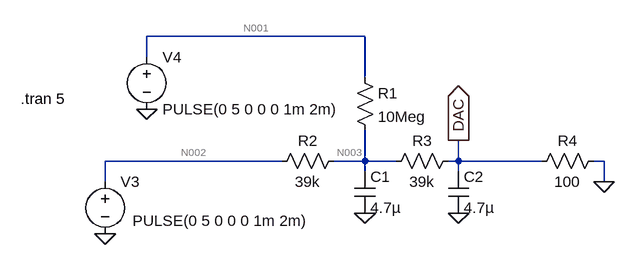
[diagram p0: schematic control-amp.asc]
control-amp.asc, the LTspice schematic file:
Version 4
SHEET 1 880 680
WIRE -496 -176 -832 -176
WIRE -832 -144 -832 -176
WIRE -496 -112 -496 -176
WIRE -624 16 -896 16
WIRE -496 16 -496 -32
WIRE -496 16 -544 16
WIRE -448 16 -496 16
WIRE -352 16 -352 -16
WIRE -352 16 -368 16
WIRE -224 16 -352 16
WIRE -128 16 -144 16
WIRE -496 32 -496 16
WIRE -352 32 -352 16
WIRE -896 48 -896 16
WIRE -128 48 -128 16
FLAG -896 128 0
FLAG -832 -64 0
FLAG -496 96 0
FLAG -352 96 0
FLAG -352 -16 DAC
IOPIN -352 -16 Out
FLAG -128 48 0
SYMBOL res -512 -128 R0
SYMATTR InstName R1
SYMATTR Value 10Meg
SYMBOL res -528 0 R90
WINDOW 0 0 56 VBottom 2
WINDOW 3 32 56 VTop 2
SYMATTR InstName R2
SYMATTR Value 39k
SYMBOL res -352 0 R90
WINDOW 0 0 56 VBottom 2
WINDOW 3 32 56 VTop 2
SYMATTR InstName R3
SYMATTR Value 39k
SYMBOL voltage -896 32 R0
WINDOW 123 0 0 Left 0
WINDOW 39 0 0 Left 0
WINDOW 3 42 76 Left 2
SYMATTR InstName V3
SYMATTR Value PULSE(0 5 0 0 0 1m 2m)
SYMBOL voltage -832 -160 R0
WINDOW 123 0 0 Left 0
WINDOW 39 0 0 Left 0
SYMATTR InstName V4
SYMATTR Value PULSE(0 5 0 0 0 1m 2m)
SYMBOL cap -512 32 R0
SYMATTR InstName C1
SYMATTR Value 4.7µ
SYMBOL cap -368 32 R0
SYMATTR InstName C2
SYMATTR Value 4.7µ
SYMBOL res -128 0 R90
WINDOW 0 0 56 VBottom 2
WINDOW 3 32 56 VTop 2
SYMATTR InstName R4
SYMATTR Value 100
TEXT -1026 -80 Left 2 !.tran 5

The netlist it stands for:
* control-amp.asc
R1 N001 N003 10Meg
R2 N003 N002 39k
R3 DAC N003 39k
V3 N002 0 PULSE(0 5 0 0 0 1m 2m)
V4 N001 0 PULSE(0 5 0 0 0 1m 2m)
C1 N003 0 4.7µ
C2 DAC 0 4.7µ
R4 0 DAC 100
.tran 5
.backanno
.end

* Results of the author's LTspice run, read from the files saved beside the schematic
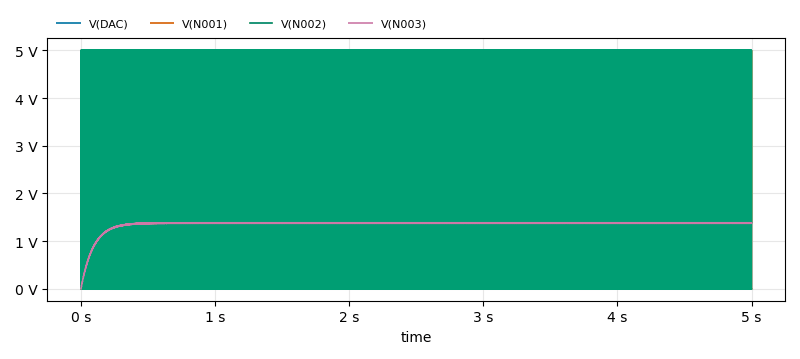
[diagram p1: Transient Analysis of control-amp.asc, plotted from the saved traces]
* Transient Analysis, 1 run:
*   V(DAC): min 0 V, max 3.535 mV, average 3.463 mV, rms 3.479 mV, last 3.525 mV
*   V(N001): min 0 V, max 5 V, average 2.75 V, rms 3.658 V, last 0 V
*   V(N002): min 0 V, max 5 V, average 2.75 V, rms 3.658 V, last 0 V
*   V(N003): min 0 V, max 1.386 V, average 1.354 V, rms 1.36 V, last 1.373 V